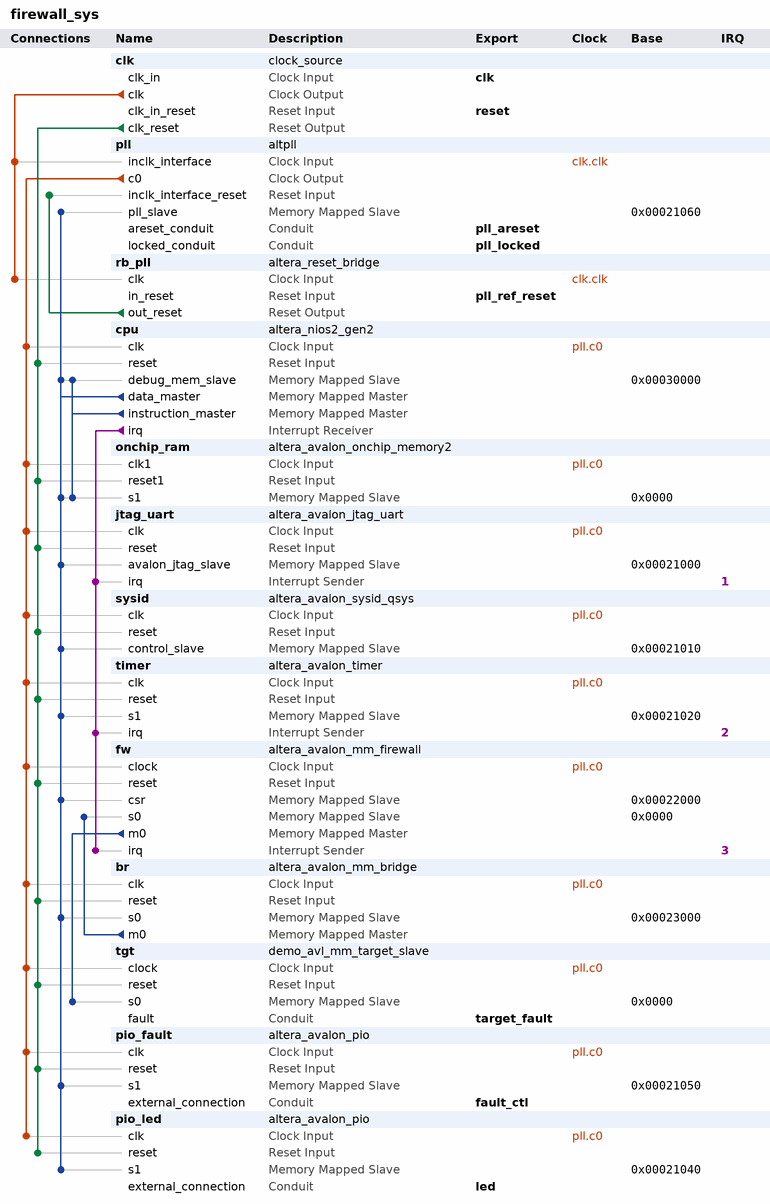
[diagram p0: system contents]
# Platform Designer (Qsys) system firewall_sys, MAX 10 10M50DAF484C7G
# Parameters at their usual value, and those the tool derives, are not listed.
package require -exact qsys 18.1
create_system firewall_sys
set_project_property DEVICE_FAMILY {MAX 10}
set_project_property DEVICE 10M50DAF484C7G

add_instance clk clock_source 18.1
set_instance_parameter_value clk clockFrequency 50000000
set_instance_parameter_value clk resetSynchronousEdges DEASSERT

add_instance pll altpll 18.1
set_instance_parameter_value pll CLK0_DIVIDE_BY 1
set_instance_parameter_value pll CLK0_MULTIPLY_BY 2
set_instance_parameter_value pll INCLK0_INPUT_FREQUENCY 20000
set_instance_parameter_value pll PORT_ARESET PORT_USED
set_instance_parameter_value pll PORT_LOCKED PORT_USED
set_instance_parameter_value pll PORT_clk1 PORT_UNUSED
set_instance_parameter_value pll PORT_clk2 PORT_UNUSED
set_instance_parameter_value pll PORT_clk3 PORT_UNUSED

add_instance rb_pll altera_reset_bridge 18.1
set_instance_parameter_value rb_pll ACTIVE_LOW_RESET 1
set_instance_parameter_value rb_pll SYNCHRONOUS_EDGES deassert

add_instance cpu altera_nios2_gen2 18.1
set_instance_parameter_value cpu dcache_size 2048
set_instance_parameter_value cpu exceptionSlave onchip_ram.s1
set_instance_parameter_value cpu icache_size 4096
set_instance_parameter_value cpu impl Fast
set_instance_parameter_value cpu mul_32_impl 1
set_instance_parameter_value cpu resetSlave onchip_ram.s1

add_instance onchip_ram altera_avalon_onchip_memory2 18.1
set_instance_parameter_value onchip_ram dataWidth 32
set_instance_parameter_value onchip_ram dualPort false
set_instance_parameter_value onchip_ram initMemContent true
set_instance_parameter_value onchip_ram initializationFileName onchip_mem.hex
set_instance_parameter_value onchip_ram memorySize 131072
set_instance_parameter_value onchip_ram singleClockOperation true

add_instance jtag_uart altera_avalon_jtag_uart 18.1
set_instance_parameter_value jtag_uart simInteractiveOptions NO_INTERACTIVE_WINDOWS

add_instance sysid altera_avalon_sysid_qsys 18.1
set_instance_parameter_value sysid id -1431655765

add_instance timer altera_avalon_timer 18.1
set_instance_parameter_value timer period 1
set_instance_parameter_value timer periodUnits MSEC

add_instance fw altera_avalon_mm_firewall 1.0
set_instance_parameter_value fw ADDR_WIDTH 12
set_instance_parameter_value fw BURST_WIDTH 5
set_instance_parameter_value fw CSR_ADDR_WIDTH 8
set_instance_parameter_value fw DATA_WIDTH 32
set_instance_parameter_value fw MAX_PENDING_READS 1
set_instance_parameter_value fw NUM_RULES 5
set_instance_parameter_value fw REGISTER_LOOKUP 1
set_instance_parameter_value fw TIMEOUT_WIDTH 20
set_instance_parameter_value fw USE_RESPONSE 1
set_instance_parameter_value fw USE_WRITE_RESPONSE 1

add_instance br altera_avalon_mm_bridge 18.1
set_instance_parameter_value br ADDRESS_UNITS SYMBOLS
set_instance_parameter_value br ADDRESS_WIDTH 10
set_instance_parameter_value br DATA_WIDTH 32
set_instance_parameter_value br MAX_BURST_SIZE 16
set_instance_parameter_value br MAX_PENDING_RESPONSES 4
set_instance_parameter_value br USE_AUTO_ADDRESS_WIDTH 1
set_instance_parameter_value br USE_RESPONSE 1

add_instance tgt demo_avl_mm_target_slave 1.0
set_instance_parameter_value tgt ADDR_WIDTH 8
set_instance_parameter_value tgt BURST_WIDTH 5
set_instance_parameter_value tgt DATA_WIDTH 32
set_instance_parameter_value tgt MEM_WORDS 64
set_instance_parameter_value tgt USE_WRITE_RESPONSE 1

add_instance pio_fault altera_avalon_pio 18.1
set_instance_parameter_value pio_fault direction Output
set_instance_parameter_value pio_fault resetValue 4
set_instance_parameter_value pio_fault width 3

add_instance pio_led altera_avalon_pio 18.1
set_instance_parameter_value pio_led direction Output
set_instance_parameter_value pio_led width 10

# connections
add_connection clk.clk pll.inclk_interface clock
add_connection clk.clk rb_pll.clk clock
add_connection pll.c0 br.clk clock
add_connection pll.c0 cpu.clk clock
add_connection pll.c0 fw.clock clock
add_connection pll.c0 jtag_uart.clk clock
add_connection pll.c0 onchip_ram.clk1 clock
add_connection pll.c0 pio_fault.clk clock
add_connection pll.c0 pio_led.clk clock
add_connection pll.c0 sysid.clk clock
add_connection pll.c0 tgt.clock clock
add_connection pll.c0 timer.clk clock
add_connection clk.clk_reset br.reset reset
add_connection clk.clk_reset cpu.reset reset
add_connection clk.clk_reset fw.reset reset
add_connection clk.clk_reset jtag_uart.reset reset
add_connection clk.clk_reset onchip_ram.reset1 reset
add_connection clk.clk_reset pio_fault.reset reset
add_connection clk.clk_reset pio_led.reset reset
add_connection clk.clk_reset sysid.reset reset
add_connection clk.clk_reset tgt.reset reset
add_connection clk.clk_reset timer.reset reset
add_connection rb_pll.out_reset pll.inclk_interface_reset reset
add_connection br.m0 fw.s0 avalon
set_connection_parameter_value br.m0/fw.s0 baseAddress 0x0000
add_connection cpu.data_master br.s0 avalon
set_connection_parameter_value cpu.data_master/br.s0 baseAddress 0x00023000
add_connection cpu.data_master cpu.debug_mem_slave avalon
set_connection_parameter_value cpu.data_master/cpu.debug_mem_slave baseAddress 0x00030000
add_connection cpu.data_master fw.csr avalon
set_connection_parameter_value cpu.data_master/fw.csr baseAddress 0x00022000
add_connection cpu.data_master jtag_uart.avalon_jtag_slave avalon
set_connection_parameter_value cpu.data_master/jtag_uart.avalon_jtag_slave baseAddress 0x00021000
add_connection cpu.data_master onchip_ram.s1 avalon
set_connection_parameter_value cpu.data_master/onchip_ram.s1 baseAddress 0x0000
add_connection cpu.data_master pio_fault.s1 avalon
set_connection_parameter_value cpu.data_master/pio_fault.s1 baseAddress 0x00021050
add_connection cpu.data_master pio_led.s1 avalon
set_connection_parameter_value cpu.data_master/pio_led.s1 baseAddress 0x00021040
add_connection cpu.data_master pll.pll_slave avalon
set_connection_parameter_value cpu.data_master/pll.pll_slave baseAddress 0x00021060
add_connection cpu.data_master sysid.control_slave avalon
set_connection_parameter_value cpu.data_master/sysid.control_slave baseAddress 0x00021010
add_connection cpu.data_master timer.s1 avalon
set_connection_parameter_value cpu.data_master/timer.s1 baseAddress 0x00021020
add_connection cpu.instruction_master cpu.debug_mem_slave avalon
set_connection_parameter_value cpu.instruction_master/cpu.debug_mem_slave baseAddress 0x00030000
add_connection cpu.instruction_master onchip_ram.s1 avalon
set_connection_parameter_value cpu.instruction_master/onchip_ram.s1 baseAddress 0x0000
add_connection fw.m0 tgt.s0 avalon
set_connection_parameter_value fw.m0/tgt.s0 baseAddress 0x0000
add_connection cpu.irq fw.irq interrupt
set_connection_parameter_value cpu.irq/fw.irq irqNumber 3
add_connection cpu.irq jtag_uart.irq interrupt
set_connection_parameter_value cpu.irq/jtag_uart.irq irqNumber 1
add_connection cpu.irq timer.irq interrupt
set_connection_parameter_value cpu.irq/timer.irq irqNumber 2

# exported interfaces
add_interface clk clock sink
set_interface_property clk EXPORT_OF clk.clk_in
add_interface fault_ctl conduit end
set_interface_property fault_ctl EXPORT_OF pio_fault.external_connection
add_interface led conduit end
set_interface_property led EXPORT_OF pio_led.external_connection
add_interface pll_areset conduit end
set_interface_property pll_areset EXPORT_OF pll.areset_conduit
add_interface pll_locked conduit end
set_interface_property pll_locked EXPORT_OF pll.locked_conduit
add_interface pll_ref_reset reset sink
set_interface_property pll_ref_reset EXPORT_OF rb_pll.in_reset
add_interface reset reset sink
set_interface_property reset EXPORT_OF clk.clk_in_reset
add_interface target_fault conduit end
set_interface_property target_fault EXPORT_OF tgt.fault

set_interconnect_requirement {$system} qsys_mm.clockCrossingAdapter HANDSHAKE
set_interconnect_requirement {$system} qsys_mm.enableEccProtection FALSE
set_interconnect_requirement {$system} qsys_mm.insertDefaultSlave FALSE
set_interconnect_requirement {$system} qsys_mm.maxAdditionalLatency 1

save_system firewall_sys.qsys
